# Altium schematic sheet Relay_module.SchDoc
size A4; SheetNumber: 1; SheetTotal: 1
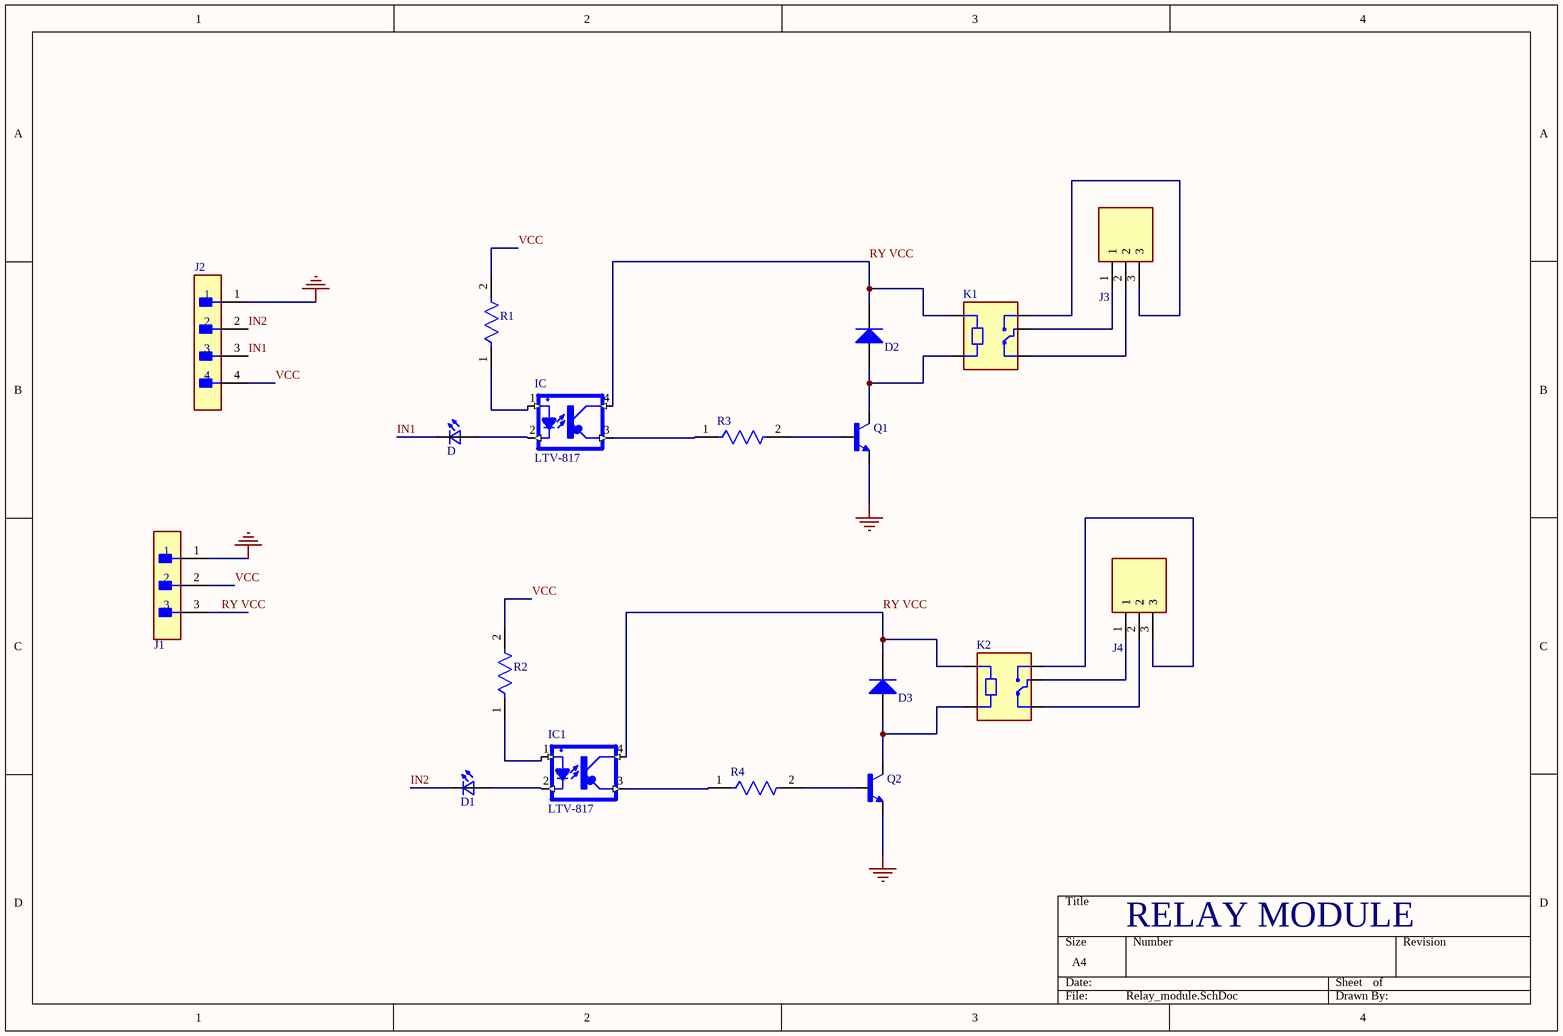
[diagram p0: Relay_module.SchDoc]

## Parts
D  LTST-C193TBKT-5A  [0603]  (value not drawn)
D1  LTST-C193TBKT-5A  [0603]  (value not drawn)
D2  1N4003-T  [DIOD-DO-41-P-2_V]  (value not drawn)
D3  1N4003-T  [DIOD-DO-41-P-2_V]  (value not drawn)
IC  LTV-817  [DIP-4]
IC1  LTV-817  [DIP-4]
J1  22-05-3031  [FP-22-05-3031-MFG]  (value not drawn)
J2  22-05-3041  [FP-22-05-3041-MFG]  (value not drawn)
J3  TB006-508-03BE  [CUI_TB006-508-03BE]  (value not drawn)
J4  TB006-508-03BE  [CUI_TB006-508-03BE]  (value not drawn)
K1  SRD-05VDC-SL-C  [RELAY_SRD-05VDC-SL-C]  (value not drawn)
K2  SRD-05VDC-SL-C  [RELAY_SRD-05VDC-SL-C]  (value not drawn)
Q1  BCW31*  [SOT23-BEC]  (value not drawn)
Q2  BCW31*  [SOT23-BEC]  (value not drawn)
R1  MRS25000C1000FRP00  [FP-MRS25-MFG]  (value not drawn)
R2  MRS25000C1000FRP00  [FP-MRS25-MFG]  (value not drawn)
R3  MRS25000C1000FRP00  [FP-MRS25-MFG]  (value not drawn)
R4  MRS25000C1000FRP00  [FP-MRS25-MFG]  (value not drawn)

## Nets
GND: J1.1 J2.1 Q1.E Q2.E
IN1: D.1(K2) J2.3
IN2: D1.1(K2) J2.2
RY VCC: D2.2(K) D3.2(K) IC.4 IC1.4 J1.3 K1.A1 K2.A1
VCC: J1.2 J2.4 R1.2 R2.2
NetD1_2: D1.2(A2) IC1.2
NetD2_1: D2.1(A) K1.A2 Q1.C
NetD3_1: D3.1(A) K2.A2 Q2.C
NetD_2: D.2(A2) IC.2
NetIC1_1: IC1.1 R2.1
NetIC1_3: IC1.3 R4.1
NetIC_1: IC.1 R1.1
NetIC_3: IC.3 R3.1
NetJ3_1: J3.1 K1.COM
NetJ3_2: J3.2 K1.NC
NetJ3_3: J3.3 K1.NO
NetJ4_1: J4.1 K2.COM
NetJ4_2: J4.2 K2.NC
NetJ4_3: J4.3 K2.NO
NetQ1_B: Q1.B R3.2
NetQ2_B: Q2.B R4.2

## Notes on the sheet
- RELAY MODULE

## Library data of the parts
D D1 = LTST-C193TBKT-5A: Blue 470nm LED Indication - Discrete 2.8V 0603 _1608 Metric_; MF: Lite-On Inc.; MP: LTST-C193TBKT-5A; Value: *; Digi-Key_Purchase_URL: https://www.digikey.com/product-detail/en/lite-on-inc/LTST-C193TBKT-5A/160-1827-1-ND/2355044?utm_source=snapeda&utm_medium=aggregator&utm_campaign=symbol; SnapEDA_Link: https://www.snapeda.com/parts/LTST-C193TBKT-5A/Lite-On%20Inc./view-part/350303/?ref=snap; Digi-Key_Part_Number: 160-1827-1-ND; Package: 0603 Lite-On
D2 D3 = CMP-0639-00004-2: 1.0 A Rectifier, 15 pF, 200 V, -65 to 150 degC, 2-Pin DO-41 Plastic, RoHS, Tape and Reel; Manufacturer: Diodes Inc; CT (pF): 15; Max. IR (uA): 5; Max. Average Rectified Current IO (A): 1; VRRM (V): 200; Max. IFSM (A): 30; PartNumber: 1N4003-T; Packing: Tape and Reel; PackageDescription: 2-Pin Axial Lead, Body 4.635 x 2.36 mm, Lead Spread 25.4 mm; Mounting Technology: Through Hole; ComponentLink2Description: Datasheet; RoHS: TRUE; DatasheetVersion: Rev. 8-2; ComponentLink1URL: http://diodes.com/; PackageReference: DO-41-P-2; ComponentLink2URL: http://diodes.com/datasheets/ds28002.pdf; VF (V): 1; ComponentLink1Description: Manufacturer URL; Operating Temperature Range (degC): -65 to 150
IC IC1 = LTV-817: Optoisolator Transistor Output 5000Vrms 1 Channel 4-SMD; MF: Lite-On Electronics; SnapEDA_Link: https://www.snapeda.com/parts/LTV-817/ICS/view-part/4478599/?ref=snap; Price: None; MP: LTV-817; Value: *; Availability: Unavailable; Package: DIP-4 Lite-On Electronics
J1 = CMP-04776-000253-1: CONN HEADER R/A 3POS 2.54MM; Number of Positions: 3; Max Current Rating: 4A; Contact Resistance: 10mR; Voltage Rating (DC): 250V; Gender: Male; Approvals: UL; Insulation Resistance: 50GR; Glow Wire Compliant: Non-compliant; Contact Plating: Tin; Packaging: Bulk; Color: White; Series: 7478; Package Quantity: 2000; Depth: 12.83mm; Mount: Through Hole; Length: 7.62mm; Fastening Type: Friction; Number of Circuits: 3; Lead Pitch: 2.54mm; Housing Color: White; Contact Type: Male Pin; Lead Free: Lead Free; Flammability Rating: UL94 V-0; Halogen Free: Low Halogen; Termination: Solder; Contact Mating Length: 0.264inch; Radiation Hardening: No; Min Operating Temperature: 0°C; Pitch: 2.54mm; RoHS Compliant: Yes; Orientation: Right Angle; Number of Rows: 1; Height: 6.35mm; Max Operating Temperature: 75°C; Voltage Rating: 250V; Contact Material: Brass; Number of Contacts: 3; Housing Material: Nylon; Current Rating: 4A
J2 = CMP-2000-05533-2: CONN HEADER R/A 4POS 2.54MM; Manufacturer: Molex; Current Rating: 4A; Description: Connector Header Through Hole, Right Angle 4 position 0.100" (2.54mm); Conn Gender: Male; Number Of Contacts: 4; Conn Orientation: Right Angle; Voltage Rating: 500V; Number Of Rows: 1; Contact Material: Tin,Nickel; Temperature Range Low: -40°C; ComponentLink2Description: Datasheet; Automotive: No; Lead Free: Yes; ComponentLink2URL: https://www.molex.com/webdocs/datasheets/pdf/en-us/0022053041_PCB_HEADERS.pdf; Octopart: https://octopart.com/22-05-3041-molex-2579; Temperature: -40°C to +80°C; Height: 6.6mm; Device Class L3: unset; Temperature Range High: +80°C; Pitch: 2.54mm; Manufacturer Part Number: 22-05-3041; Device Class L2: Headers and Wire Housings; RoHS: TRUE; Footprint Url: https://www.molex.com/pdm_docs/sd/022053041_sd.pdf; Category: Conn; Digikey Description: CONN HEADER R/A 4POS 2.54MM; Device Class L1: Connectors; Package: 0
J3 J4 = TB006-508-03BE: 2~24 Poles, Screw Type, Horizontal, 5.08 Pitch, 26~14 (AWG), Terminal Block Connector; MF: CUI Devices; Price: None; CUI_purchase_URL: https://www.cuidevices.com/product/interconnect/connectors/terminal-blocks/tb006-508-series?utm_source=snapeda.com&utm_medium=referral&utm_campaign=snapedaBOM; Purchase-URL: https://pricing.snapeda.com/search/part/TB006-508-03BE/?ref=eda; MP: TB006-508-03BE; Value: *; Package: None; SnapEDA_Link: https://www.snapeda.com/parts/TB006-508-03BE/CUI+Devices/view-part/?ref=snap; Availability: In Stock; Check_prices: https://www.snapeda.com/parts/TB006-508-03BE/CUI+Devices/view-part/?ref=eda
K1 K2 = SRD-05VDC-SL-C: 5V Trigger Relay Module For Arduino And Raspberry Pi 5V Trigger Relay Module For Arduino And Raspberry Pi; MF: Songle Relay; Check_prices: https://www.snapeda.com/parts/SRD-05VDC-SL-C/Songle+Relay/view-part/?ref=eda; Value: *; Availability: Not in stock; Price: None; Package: NON STANDARD-5 Songle Relay; MP: SRD-05VDC-SL-C; SnapEDA_Link: https://www.snapeda.com/parts/SRD-05VDC-SL-C/Songle+Relay/view-part/?ref=snap
Q1 Q2 = BCW31*: Bipolar (BJT) Transistor NPN General Purpose Amplifier Surface Mount; MF: ON Semiconductor; MP: BCW31; SnapEDA_Link: https://www.snapeda.com/parts/BCW31/Onsemi/view-part/?ref=snap; Package: SOT-23 ON Semiconductor; Value: *; Check_prices: https://www.snapeda.com/parts/BCW31/Onsemi/view-part/?ref=eda
R1-R4 = CMP-00030-42757237-1: MRS25000C1000FRP00 Resistor, 100 Ohm, ± 1%, 600 mW, Axial Leaded, Metal Film (Thin Film), Professional; Max Power Dissipation: 600mW; Resistance: 100Ω; Voltage Rating: 350V; Temperature Coefficient: 50ppm/°C; Lead Diameter: 600µm; RoHS: Compliant; Radiation Hardening: No; Schedule B: 8533210090, 8533210090; Length: 6.5mm; Packaging: Tape & Reel (TR); Number of Terminations: 2; Mount: Through Hole; Width: 2.5mm; Tolerance: 1%; Military Standard: Not; Voltage Rating (DC): 350V; Contact Plating: Tin; Number of Pins: 2; Max Operating Temperature: 155°C; NexarPartId: 42757237; Diameter: 2.5mm; Composition: Metal Film, Thin Film; REACH SVHC: Unknown; Power Rating: 600mW; Lead Free: Lead Free; Termination: Axial; Case/Package: Axial; Min Operating Temperature: -55°C